# EAGLE design ch340_usb (EAGLE 9.6.2)
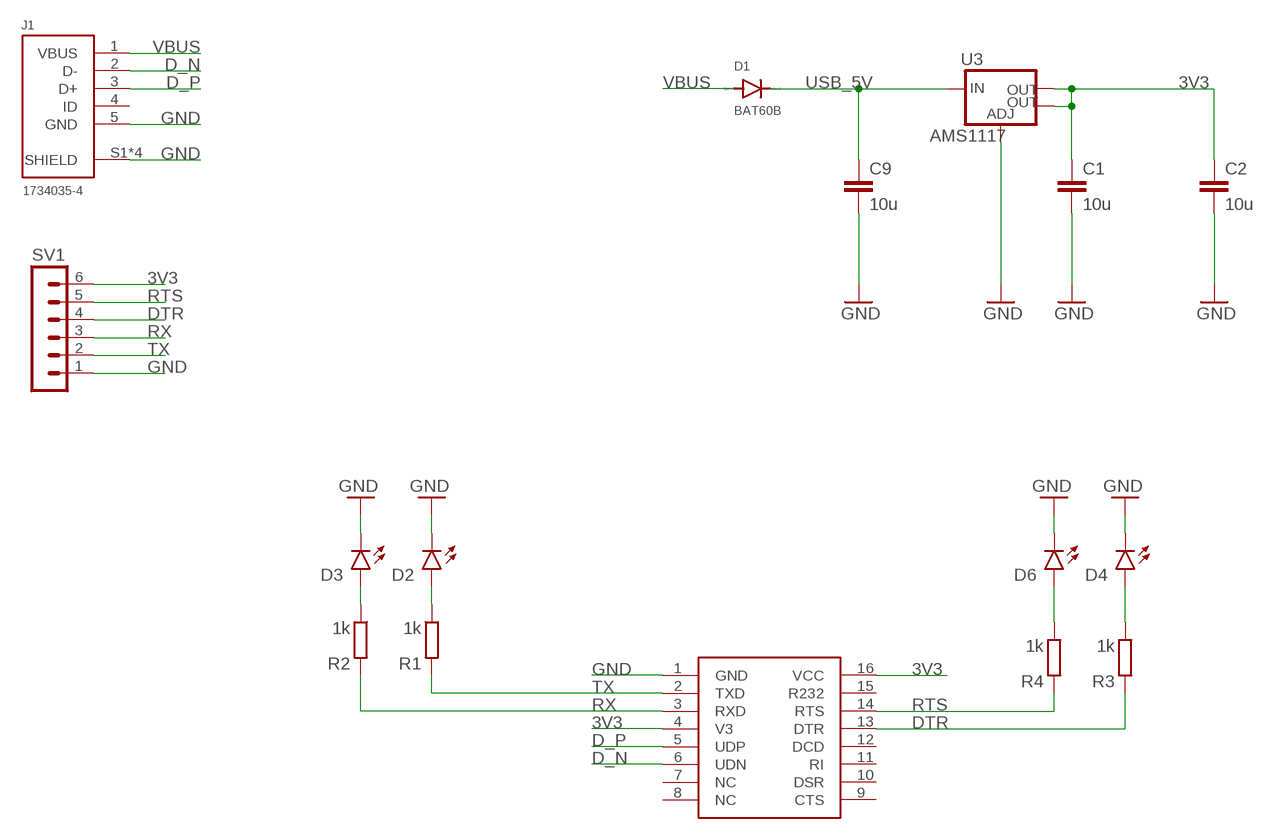
[diagram p0: schematic, sheet 1]

## Parts
C1  10u  C-EUC0805K  [C0805K]
C2  10u  C-EUC0805K  [C0805K]
C9  10u  C-EUC0805K  [C0805K]
D1  BAT60B  MBR0520LT  [SOD123]
D2  PWR  TLLG4400  [LED3MM]
D3  PWR  TLLG4400  [LED3MM]
D4  PWR  TLLG4400  [LED3MM]
D6  PWR  TLLG4400  [LED3MM]
J1  1734035-4  [1734035-4]
R1  1k  R-EU_R0805  [R0805]
R2  1k  R-EU_R0805  [R0805]
R3  1k  R-EU_R0805  [R0805]
R4  1k  R-EU_R0805  [R0805]
SV1  MA06-1  [MA06-1]
U3  AMS1117  V_REG_LM1117SOT223  [SOT223]
U$1  CH340  [SOP16]

## Nets
3V3: C1.1 C2.1 SV1.6 U3.2(OUT) U3.4(OUT) U$1.4(V3) U$1.16(VCC)
D_N [usb]: J1.2(D-) U$1.6(UDN)
D_P [usb]: J1.3(D+) U$1.5(UDP)
DTR: R3.2 SV1.4 U$1.13(DTR)
GND: C1.2 C2.2 C9.2 D2.K(C) D3.K(C) D4.K(C) D6.K(C) J1.5(GND) J1.S1(SHIELD) J1.S2(SHIELD) J1.S3(SHIELD) J1.S4(SHIELD) SV1.1 U3.1(ADJ) U$1.1(GND)
N$1: D3.A R2.1
N$2: D2.A R1.1
N$3: D6.A R4.1
N$4: D4.A R3.1
RTS: R4.2 SV1.5 U$1.14(RTS)
RX: R2.2 SV1.3 U$1.3(RXD)
TX: R1.2 SV1.2 U$1.2(TXD)
USB_5V: C9.1 D1.C U3.3(IN)
VBUS: D1.A J1.1(VBUS)
Unconnected: J1.4(ID) U$1.7(NC) U$1.8(NC) U$1.9(CTS) U$1.10(DSR) U$1.11(RI) U$1.12(DCD) U$1.15(R232)

## Library data of the parts
C1 C2 C9 = rcl:C-EU: CAPACITOR, European symbol; SPICEPREFIX: C
D1 = diode:MBR0520LT: SCHOTTKY BARRIER RECTIFIER Source: http://onsemi.com .. MBR0520LT1-D.pdf
D2-D4 D6 = led_larger_pads:TLLG4400: Low Current (2mA) LED 3 mm Tinted Diffused Package color GREEN Source: Data sheet <http://www.farnell.com/datasheets/391098.pdf>; MF: VISHAY SEMICONDUCTOR; OC_FARNELL: 1612435
J1 = USB connector:1734035-4: CONN RCPT USB2.0 MINI B SMD R/A Manufacturer's datasheet <https://www.te.com/commerce/DocumentDelivery/DDEController?Action=srchrtrv&DocNm=1734035&DocType=Customer+Drawing&DocLang=English>; CREATED_BY: PCBLayout.com; DIGIKEY_PARTNO: A121554TR-ND; MANUFACTURER: TE Connectivity AMP Connectors; MPN: 1734035-4
R1-R4 = rcl:R-EU_: RESISTOR, European symbol; SPICEPREFIX: R
SV1 = con-lstb:MA06-1: PIN HEADER; OC_FARNELL: unknown; OC_NEWARK: unknown
U3 = SparkFun-IC-Power:V_REG_LM1117: Voltage Regulator LM1117 Standard adjustable voltage regulator but in SMD form. Spark Fun Electronics SKU : COM-00595; PROD_ID: VREG-08170
U$1 = ch340:CH340

## Net classes
1 usb: width 0.254 mm, clearance 0.254 mm

## Board
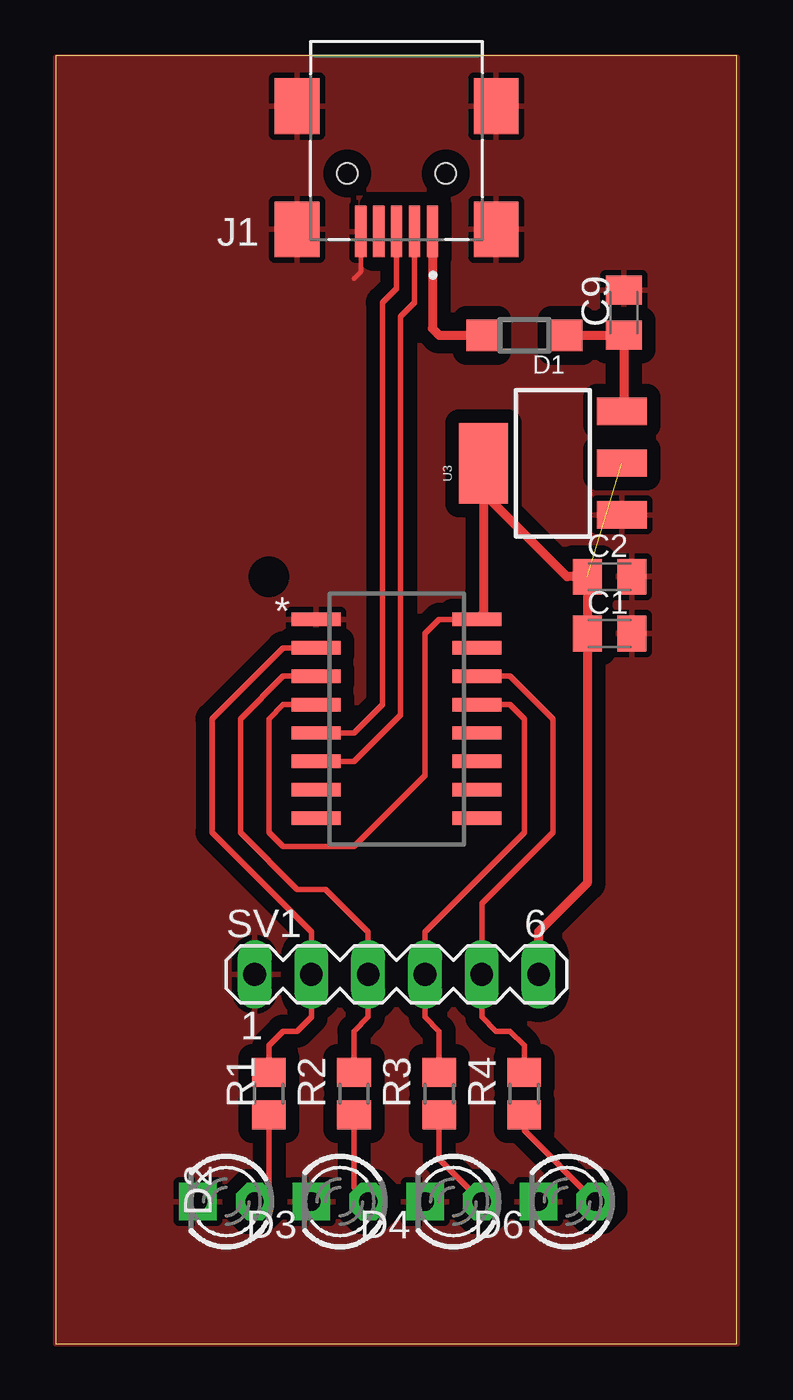
[diagram p1: board, top side]

Size 30.46 x 57.58 mm. Coordinates in mm from the lower left corner, seen from the top.
Outline: 0,0 30.46,0 30.46,57.58 0,57.58 0,0
Copper layers (1*16): Top 0.035mm / dielectric 1.5mm / Bottom 0.035mm
Design rules "default *": minimum track width 6mil, minimum drill 0.35mm, track to track 6mil, track to pad 6mil, pad to pad 6mil, via to via 6mil, smd to smd 6mil, copper to edge 0mil, drill to drill 6mil, minimum pad ring 10mil, minimum via ring 8mil, stop-mask expansion 4mil, vias tented up to drill 0mil, thermal gap 10mil
tRestrict: area 9.3,34 to 9.8,34.5

### Footprints (pad centres in the part's own frame; a part is rotated, then mirrored left to right if it is on the bottom)
C0805K = smd 1.3 x 1.6: 1 -1,0; 2 1,0
SOD123 = smd 1.4 x 1.4: A 1.9,0; C -1.9,0
LED3MM = drill 0.813 pad 1.676 octagon: A -1.27,0 | drill 0.813 pad 1.676 square: K 1.27,0
1734035-4 = smd 0.5 x 2.3: 1 -1.6,2.6; 2 -0.8,2.6; 3 0,2.6; 4 0.8,2.6; 5 1.6,2.6 | smd 2 x 2.5: S1 -4.45,2.5; S2 4.45,2.5; S3 -4.45,-3; S4 4.45,-3 | hole 0.9: -2.2,0; 2.2,0
R0805 = smd 1.3 x 1.5: 1 -0.95,0; 2 0.95,0
MA06-1 = drill 1.016 long: 1 -6.35,0; 2 -3.81,0; 3 -1.27,0; 4 1.27,0; 5 3.81,0; 6 6.35,0
SOT223 = smd 1.219 x 2.235: 1 -2.311,-3.099; 2 0,-3.099; 3 2.311,-3.099 | smd 3.6 x 2.2: 4 0,3.099
SOP16 = smd 2.2 x 0.6: 1 -3.6,4.445; 2 -3.6,3.175; 3 -3.6,1.905; 4 -3.6,0.635; 5 -3.6,-0.635; 6 -3.6,-1.905; 7 -3.6,-3.175; 8 -3.6,-4.445; 9 3.6,-4.445; 10 3.6,-3.175; 11 3.6,-1.905; 12 3.6,-0.635; 13 3.6,0.635; 14 3.6,1.905; 15 3.6,3.175; 16 3.6,4.445

### Placement (x,y rotation side)
C1  24.77,31.75 0 top
C2  24.77,34.29 0 top
C9  25.4,46.1 90 top
D1  20.95,45.09 180 top
D2  7.62,6.35 180 top
D3  12.7,6.35 180 top
D4  17.78,6.35 180 top
D6  22.86,6.35 180 top
J1  15.24,52.32 180 top
R1  9.53,11.18 90 top
R2  13.34,11.18 90 top
R3  17.14,11.18 90 top
R4  20.95,11.18 90 top
SV1  15.24,16.51 0 top
U3  22.23,39.37 90 top
U$1  15.24,27.94 0 top

### Tracks (layer width: path | path; a pad name or v marks a point on that pad's centre or on a via)
3V3  (1 unrouted)
  Top 0.254: U$1.4 10.16,28.57 9.53,27.94 9.53,22.86 10.16,22.23 13.34,22.23 16.51,25.4 16.51,31.75 17.14,32.38 U$1.16
  Top 0.406: U$1.16 19.13,32.67 U3.4 19.13,38.02 22.86,34.29 C2.1 C1.1 23.77,20.59 21.59,18.41 SV1.6
D_N
  Top 0.254: J1.2 16.04,46.55 15.4,45.91 15.4,28.11 13.34,26.04 U$1.6
D_P
  Top 0.254: J1.3 15.24,47.18 14.61,46.55 14.61,28.57 13.34,27.3 U$1.5
DTR
  Top 0.254: R3.2 17.14,13.97 16.51,14.61 SV1.4 16.51,18.41 20.95,22.86 20.95,27.94 20.32,28.57 U$1.13
GND
  Top 0.203: J1.5 13.64,47.93 13.34,47.62
  pour Top (isolate 0.61): 0,0 30.48,0 30.48,57.53 0,57.53
N$1
  Top 0.254: R2.1 13.34,6.99 D3.A
N$2
  Top 0.254: R1.1 9.53,6.99 D2.A
N$3
  Top 0.254: R4.1 20.95,9.53 D6.A
N$4
  Top 0.254: R3.1 17.14,8.26 D4.A
RTS
  Top 0.254: R4.2 20.95,13.34 20.32,13.97 19.68,13.97 19.05,14.61 SV1.5 19.05,19.68 22.23,22.86 22.23,27.94 20.32,29.84 U$1.14
RX
  Top 0.254: R2.2 13.34,13.97 13.97,14.61 SV1.3 13.97,18.41 12.06,20.32 10.79,20.32 8.26,22.86 8.26,27.94 10.16,29.84 U$1.3
TX
  Top 0.254: R1.2 9.53,13.34 10.16,13.97 10.79,13.97 11.43,14.61 SV1.2 11.43,18.41 6.99,22.86 6.99,27.94 10.16,31.11 U$1.2
USB_5V
  Top 0.406: D1.C 22.87,45.1 C9.1 25.4,41.76 U3.3
VBUS
  Top 0.406: J1.1 16.84,45.39 17.14,45.09 D1.A